# Altium schematic sheet TOP.SchDoc: =DocumentName
size A4; Organization: Queen's Formula SAE; Address1: 130 Stuart St, Kingston; Address2: Ontario; Address3: Canada; Address4: K7L 2V9; DocumentNumber: 1; Revision: 0; SheetNumber: 1; SheetTotal: 1
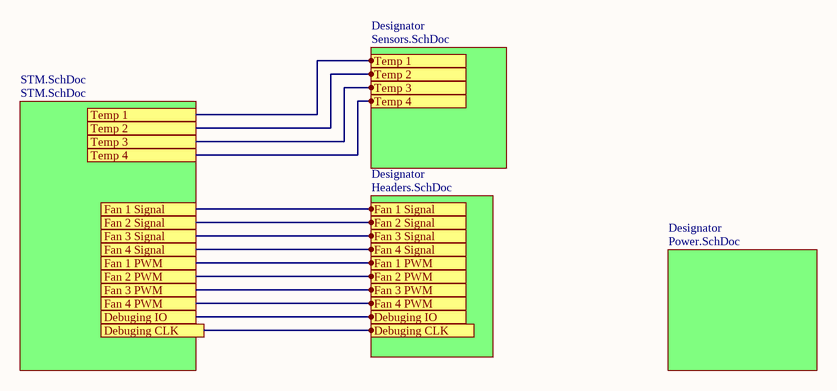
[diagram p0: TOP.SchDoc]

## Sub-sheets
Designator = Sensors.SchDoc: Temp 1, Temp 2, Temp 3, Temp 4
Designator = Power.SchDoc: no entries
Designator = Headers.SchDoc: Fan 1 Signal, Fan 2 Signal, Fan 3 Signal, Fan 4 Signal, Fan 1 PWM, Fan 2 PWM, Fan 3 PWM, Fan 4 PWM, Debuging IO, Port
STM.SchDoc = STM.SchDoc: no entries

## Ports
Debuging CLK, Debuging IO, Fan 1 PWM, Fan 1 Signal, Fan 2 PWM, Fan 2 Signal, Fan 3 PWM, Fan 3 Signal, Fan 4 PWM, Fan 4 Signal, Temp 1, Temp 2, Temp 3, Temp 4

## Nets
Debuging CLK: port Debuging CLK, sheet Designator/Port
Debuging IO: port Debuging IO, sheet Designator/Debuging IO
Fan 1 PWM: port Fan 1 PWM, sheet Designator/Fan 1 PWM
Fan 1 Signal: port Fan 1 Signal, sheet Designator/Fan 1 Signal
Fan 2 PWM: port Fan 2 PWM, sheet Designator/Fan 2 PWM
Fan 2 Signal: port Fan 2 Signal, sheet Designator/Fan 2 Signal
Fan 3 PWM: port Fan 3 PWM, sheet Designator/Fan 3 PWM
Fan 3 Signal: port Fan 3 Signal, sheet Designator/Fan 3 Signal
Fan 4 PWM: port Fan 4 PWM, sheet Designator/Fan 4 PWM
Fan 4 Signal: port Fan 4 Signal, sheet Designator/Fan 4 Signal
Temp 1: port Temp 1, sheet Designator/Temp 1
Temp 2: port Temp 2, sheet Designator/Temp 2
Temp 3: port Temp 3, sheet Designator/Temp 3
Temp 4: port Temp 4, sheet Designator/Temp 4

## Notes on the sheet
- Title
- Size:
- Date:
- A4
- Number:
- Time:
- Revision:
- Sheet
- of
- File: